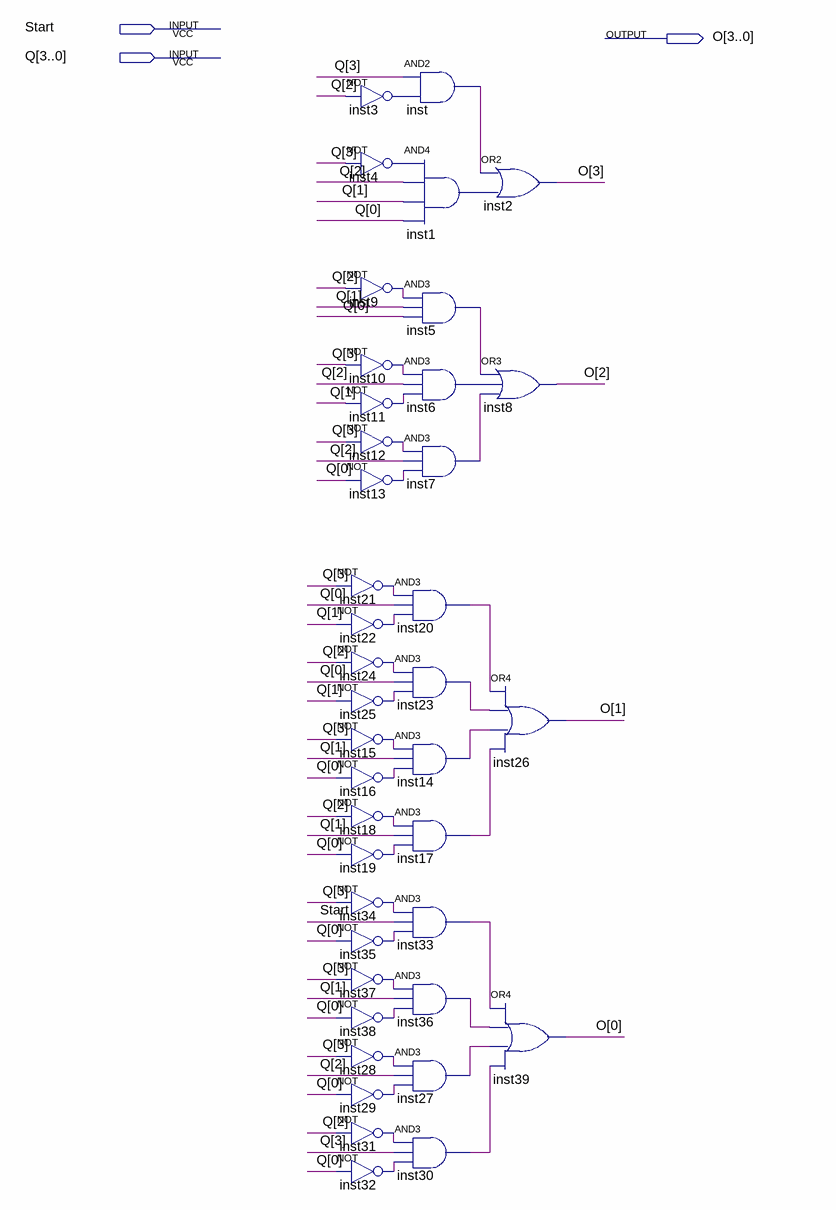
[diagram p0: schematic sheet]
// Quartus schematic Next_12state.bdf as structural Verilog: 40 symbols, 3 pins
module Next_12state (
  input  Start,
  input  [3:0] Q,
  output [3:0] O
);

  wire inst1_out, inst3_out, inst4_out, inst5_out, inst6_out, inst7_out, inst9_out, inst10_out, inst11_out,
       inst12_out, inst13_out, inst14_out, inst15_out, inst16_out, inst17_out, inst18_out, inst19_out,
       inst20_out, inst21_out, inst22_out, inst23_out, inst24_out, inst25_out, inst27_out, inst28_out,
       inst29_out, inst30_out, inst31_out, inst32_out, inst33_out, inst34_out, inst35_out, inst36_out,
       inst37_out, inst38_out, inst_out;

  and inst (inst_out, Q[3], inst3_out);
  not inst3 (inst3_out, Q[2]);
  and inst1 (inst1_out, inst4_out, Q[2], Q[1], Q[0]);
  not inst4 (inst4_out, Q[3]);
  not inst9 (inst9_out, Q[2]);
  and inst5 (inst5_out, inst9_out, Q[1], Q[0]);
  not inst10 (inst10_out, Q[3]);
  and inst6 (inst6_out, inst10_out, Q[2], inst11_out);
  not inst11 (inst11_out, Q[1]);
  not inst12 (inst12_out, Q[3]);
  and inst7 (inst7_out, inst12_out, Q[2], inst13_out);
  not inst13 (inst13_out, Q[0]);
  not inst21 (inst21_out, Q[3]);
  and inst20 (inst20_out, inst21_out, Q[0], inst22_out);
  not inst22 (inst22_out, Q[1]);
  not inst24 (inst24_out, Q[2]);
  and inst23 (inst23_out, inst24_out, Q[0], inst25_out);
  not inst25 (inst25_out, Q[1]);
  not inst15 (inst15_out, Q[3]);
  and inst14 (inst14_out, inst15_out, Q[1], inst16_out);
  not inst16 (inst16_out, Q[0]);
  not inst18 (inst18_out, Q[2]);
  and inst17 (inst17_out, inst18_out, Q[1], inst19_out);
  not inst19 (inst19_out, Q[0]);
  not inst34 (inst34_out, Q[3]);
  and inst33 (inst33_out, inst34_out, Start, inst35_out);
  not inst35 (inst35_out, Q[0]);
  not inst37 (inst37_out, Q[3]);
  and inst36 (inst36_out, inst37_out, Q[1], inst38_out);
  not inst38 (inst38_out, Q[0]);
  not inst28 (inst28_out, Q[3]);
  and inst27 (inst27_out, inst28_out, Q[2], inst29_out);
  not inst29 (inst29_out, Q[0]);
  not inst31 (inst31_out, Q[2]);
  and inst30 (inst30_out, inst31_out, Q[3], inst32_out);
  not inst32 (inst32_out, Q[0]);
  or inst2 (O[3], inst_out, inst1_out);
  or inst8 (O[2], inst5_out, inst6_out, inst7_out);
  or inst26 (O[1], inst20_out, inst23_out, inst14_out, inst17_out);
  or inst39 (O[0], inst33_out, inst36_out, inst27_out, inst30_out);
endmodule
